# Altium schematic sheet VREG RT9166-18PVL.SchDoc
size 90 x 54 mm
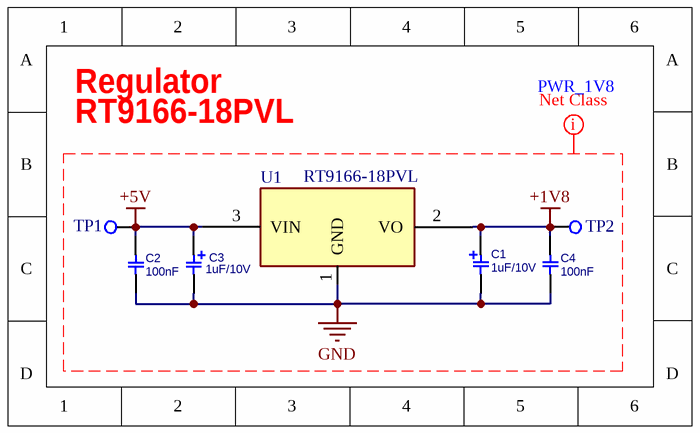
[diagram p0: VREG RT9166-18PVL.SchDoc]

## Parts
C1  1uF/10V  [C_TN_3216]
C2  100nF  [C0603S]
C3  1uF/10V  [C_TN_3216]
C4  100nF  [C0603S]
TP1  Test Point  [TPSMD_C1]  (value not drawn)
TP2  Test Point  [TPSMD_C1]  (value not drawn)
U1  RT9166-18PVL  [SOT23_3]

## Nets
+1V8: C1.1 C4.1 TP2.1(TP) U1.2(VO)
+5V: C2.1 C3.1 TP1.1(TP) U1.3(VIN)
GND: C1.2 C2.2 C3.2 C4.2 U1.1(GND)

## Layout directives
net class PWR_1V8: +1V8, +5V, GND

## Notes on the sheet
- RT9166-18PVL
- Regulator
- PWR_1V8

## Library data of the parts
C1 C3 = CAP_SMD_TAN: CAP, SMD, TAN; PARAM: 10V; VALUE: 1uF/10V
C2 C4 = CAP_SMD_MLCC: CAP, SMD, MLCC; PARAM: 50V; DESC: CAP, MLCC, 1nF, 50V, C0G, 10%, 0402; MANF_P#: MANF_PART#; MANF: Murata; PARAM2: C0G, 10%; PRICE: 100= 1$; ASSEMBLY: ASSEMBLY; VALUE: 100nF
U1 = VREG_RT9166A-18PVL_SOT23: REG, Linear, Fixed, 1.8v, 0.3A/0.6A, SOT23; MANF: TI; PARAM: 1.8V, 0.3mA/06mA; MANF_P#: RT9166-18PVL; PARAM2: 1.8V; VALUE: RT9166-18PVL